# EAGLE design faun-two-layer-lipo-v1.0 (EAGLE 6.5.0)
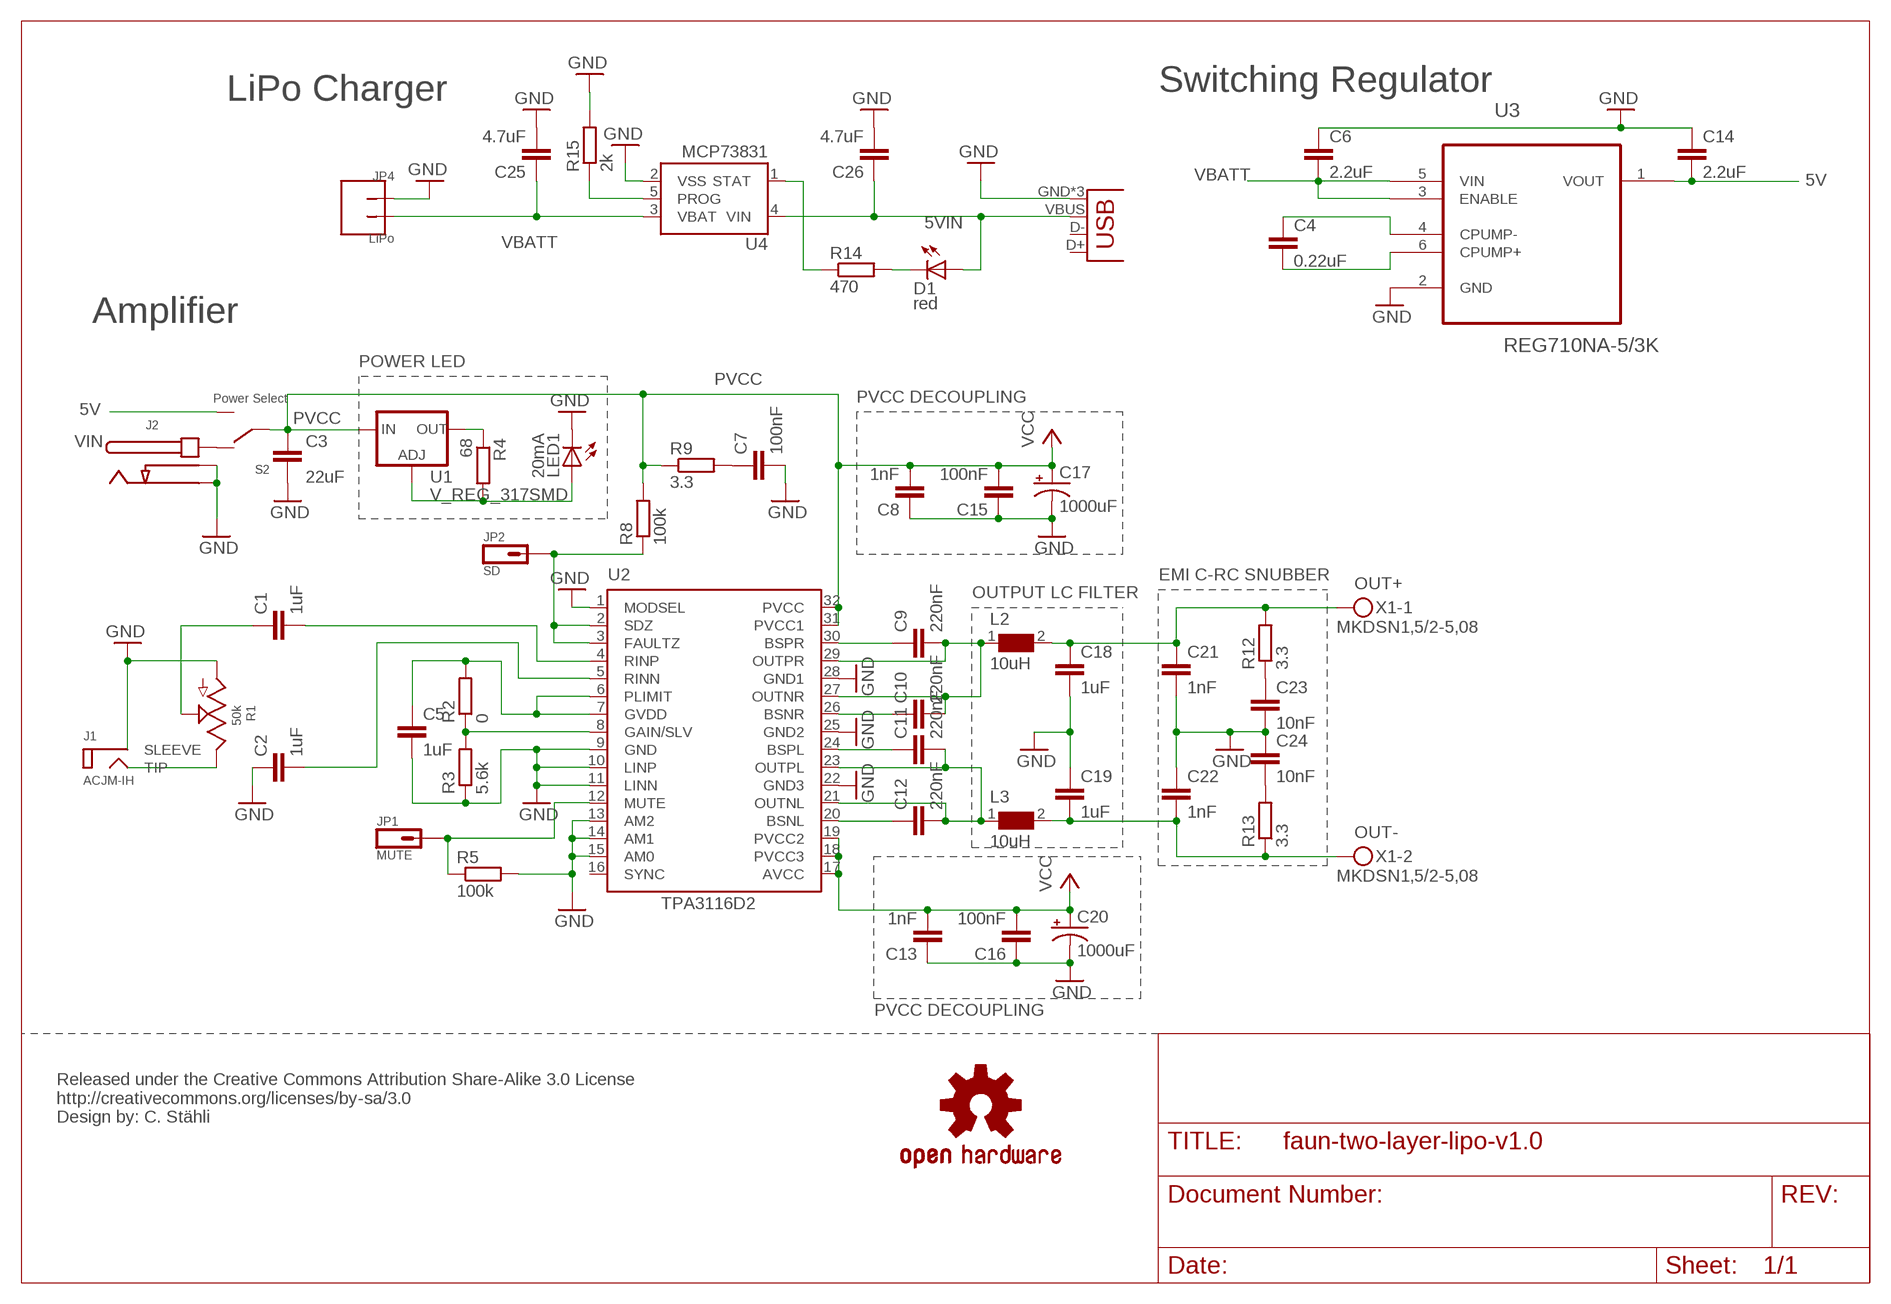
[diagram p0: schematic, sheet 1]

## Parts
C1  1uF  C-EUC1206  [C1206]
C2  1uF  C-EUC1206  [C1206]
C3  22uF  C-EUC1206  [C1206]
C4  0.22uF  C-EUC1206  [C1206]
C5  1uF  C-EUC1206  [C1206]
C6  2.2uF  C-EUC1206  [C1206]
C7  100nF  C-EUC1206  [C1206]
C8  1nF  C-EUC1206  [C1206]
C9  220nF  C-EUC1206  [C1206]
C10  220nF  C-EUC1206  [C1206]
C11  220nF  C-EUC1206  [C1206]
C12  220nF  C-EUC1206  [C1206]
C13  1nF  C-EUC1206  [C1206]
C14  2.2uF  C-EUC1206  [C1206]
C15  100nF  C-EUC1206  [C1206]
C16  100nF  C-EUC1206  [C1206]
C17  1000uF  UES1E102MHM  [UES1E102MHM]
C18  1uF  C-EUC1206  [C1206]
C19  1uF  C-EUC1206  [C1206]
C20  1000uF  UES1E102MHM  [UES1E102MHM]
C21  1nF  C-EUC1206  [C1206]
C22  1nF  C-EUC1206  [C1206]
C23  10nF  C-EUC1206  [C1206]
C24  10nF  C-EUC1206  [C1206]
C25  4.7uF  C-EUC1206  [C1206]
C26  4.7uF  C-EUC1206  [C1206]
D1  red  LED1206  [LED-1206]
J1  ACJM-IH  [ACJM-IH]
J2  PJ-102AH  [PJ-102AH]
JP1  MUTE  M01SMD-4.5X1.5  [PAD-1.5X4.5]
JP2  SD  M01SMD-4.5X1.5  [PAD-1.5X4.5]
JP4  LiPo  1778764  [1778764]
L2  10uH  WE-PD_1260/1245/1280/1210  [WE-PD_1260/1245/1280/1210]
L3  10uH  WE-PD_1260/1245/1280/1210  [WE-PD_1260/1245/1280/1210]
LED1  20mA  LED1206  [LED-1206]
OPEN_HARDWARE_LOGO  OSHW-LOGOL  [OSHW-LOGO-L]
OPEN_HARDWARE_LOGO_TOP  OSHW-LOGOL  [OSHW-LOGO-L]
R1  50k  PTD902-2015K-A503  [PTD902-2015K]
R2  0  R-EU_R1206  [R1206]
R3  5.6k  R-EU_R1206  [R1206]
R4  68  R-EU_R1206  [R1206]
R5  100k  R-EU_R1206  [R1206]
R8  100k  R-EU_R1206  [R1206]
R9  3.3  R-EU_R1206  [R1206]
R12  3.3  R-EU_R1206  [R1206]
R13  3.3  R-EU_R1206  [R1206]
R14  470  R-EU_R1206  [R1206]
R15  2k  R-EU_R1206  [R1206]
S2  Power Select  MS-100845  [MS-100845]
U1  V_REG_317SMD  [SOT223]
U2  TPA3116D2  [TPA3116D2]
U3  REG710NA-5/3K  [SOT95P280X145-6N]
U4  MCP73831  [SOT23-5]
X1  MKDSN1,5/2-5,08  [MKDSN1,5/2-5,08]
X2  USB-MICROB  [USB-MICROB]

## Nets
5V: C14.2 S2.P$3 U3.1(VOUT)
5VIN: C26.1 D1.A U4.4(VIN) X2.VBUS
GND: C2.1 C3.2 C5.2 C6.1 C7.2 C8.1 C13.1 C14.1 C15.1 C16.1 C17.- C18.2 C19.1 C20.- C21.2 C22.1 C23.2 C24.1 C25.2 C26.2 J1.SLEEVE@1(SLEEVE) J1.SLEEVE@2(SLEEVE) J2.GND@1 J2.GND@2 JP4.1 LED1.C R1.1 R1.1' R3.1 R5.2 R15.2 U2.1(MODSEL) U2.9(GND) U2.10(LINP) U2.11(LINN) U2.13(AM2) U2.14(AM1) U2.15(AM0) U2.22(GND3) U2.25(GND2) U2.28(GND1) U3.2(GND) U4.2(VSS) X2.GND X2.MT1(GND) X2.MT2(GND)
MUTE: JP1.P$1 R5.1 U2.12(MUTE)
N$1: C5.1 R2.2 U2.6(PLIMIT) U2.7(GVDD)
N$2: C9.1 U2.30(BSPR)
N$3: C2.2 U2.5(RINN)
N$4: J1.TIP@1(TIP) J1.TIP@2(TIP) R1.3 R1.3'
N$5: C1.2 U2.4(RINP)
N$6: C1.1 R1.2 R1.2'
N$7: C7.1 R9.2
N$8: R4.1 U1.2(OUT)
N$9: C10.1 U2.26(BSNR)
N$10: C9.2 C10.2 L2.1 U2.27(OUTNR) U2.29(OUTPR)
N$11: C11.1 U2.24(BSPL)
N$12: LED1.A R4.2 U1.1(ADJ)
N$13: C12.1 U2.20(BSNL)
N$14: C11.2 C12.2 L3.1 U2.21(OUTNL) U2.23(OUTPL)
N$15: R2.1 R3.2 U2.8(GAIN/SLV)
N$16: R15.1 U4.5(PROG)
N$17: C23.1 R12.1
N$18: C24.2 R13.2
N$19: R14.1 U4.1(STAT)
N$20: D1.C R14.2
N$21: C4.1 U3.4(CPUMP-)
N$22: C4.2 U3.6(CPUMP+)
OUT+: C18.1 C21.1 L2.2 R12.2 X1.1
OUT-: C19.2 C22.2 L3.2 R13.1 X1.2
PVCC: C3.1 C8.2 C13.2 C15.2 C16.2 C17.+ C20.+ R8.2 R9.1 S2.P$2(COMM) U1.3(IN) U2.17(AVCC) U2.18(PVCC3) U2.19(PVCC2) U2.31(PVCC1) U2.32(PVCC) ; supply symbol labelled VCC
SD: JP2.P$1 R8.1 U2.2(SDZ) U2.3(FAULTZ)
VBATT: C6.2 C25.1 JP4.2 U3.3(ENABLE) U3.5(VIN) U4.3(VBAT)
VIN: J2.VCC S2.P$1
Unconnected: U2.16(SYNC) X2.D+ X2.D-

## Notes on the sheet
- LiPo Charger
- Switching Regulator
- Amplifier
- POWER LED
- PVCC DECOUPLING
- EMI C-RC SNUBBER
- OUTPUT LC FILTER
- PVCC DECOUPLING
- Released under the Creative Commons Attribution Share-Alike 3.0 License
  http://creativecommons.org/licenses/by-sa/3.0
  Design by: C. Stähli

## Library data of the parts
C1-C16 C18 C19 C21-C26 = rcl:C-EU: CAPACITOR, European symbol
C17 C20 = faun:UES1E102MHM
D1 = SparkFun-LED:LED: LEDs Standard schematic elements and footprints for 5mm, 3mm, 1206, and 0603 sized LEDs. 5mm - Spark Fun Electronics SKU : COM-00529 (and others)
J1 = faun:ACJM-IH: 1/4” (6.35mmø) Jack, Horizontal PCB mount, Plastic housing and Bezel with threaded Metal nut.
J2 = faun:PJ-102AH
JP1 JP2 = faun:M01: Header 1 Standard 1-pin 0.1" header. Use with straight break away headers (SKU : PRT-00116), right angle break away headers (PRT-00553), swiss pins (PRT-00743), machine pins (PRT-00117), and female headers (PRT-00115).
JP4 = faun:1778764
L2 L3 = faun:WE-PD: SMD-Shielded Power Inductors WE-PD - Magnetically shielded version which results in a low leakage field - High storage capacity - Low self-losses - Highest possible current loading for SMD-Inducors -- Switching regulators with low operating voltages (computer, laptop, mobile phones, pagers) -- Integrated DC/DC-converter -- Is recommended for the application with switching regulators from National Semiconductor, Linear Technology, Texas Instruments and Fairchild Semiconductor, ect. -- Graphic cards -- Plastic base: Because of the one piece construction these are more suitable for high vibration or shock applications
LED1 = faun:LED: LEDs Standard schematic elements and footprints for 5mm, 3mm, 1206, and 0603 sized LEDs. 5mm - Spark Fun Electronics SKU : COM-00529 (and others)
OPEN_HARDWARE_LOGO OPEN_HARDWARE_LOGO_TOP = faun:OSHW-LOGO: Open Source Hardware Logo This logo indicates the piece of hardware it is found on incorporates a OSHW license and/or adheres to the definition of open source hardware found here: http://freedomdefined.org/OSHW
R1 = faun:PTD902-2015K-A503: PTD90 Series - 9 mm Multi-Ganged Potentiometer Manufacturer: Bourns Product Category: Potentiometers RoHS: RoHS Compliant Details Product: Dual Potentiometer Mounting Style: Through Hole Taper: Audio Number of Turns: 1 Resistance: 50 kOhms Power Rating: 25 mW Element Type: Carbon Shaft Type: Knurled / Serrated Termination Style: Pin Tolerance: 20 % Packaging: Bulk Shaft Diameter: 6 mm Shaft Length: 15 mm Factory Pack Quantity: 144
R2-R5 R8 R9 R12-R15 = rcl:R-EU_: RESISTOR, European symbol
S2 = faun:MS-100845: Slide Switches ON-OFF-ON SPDT
U1 = faun:V_REG_317: Voltage Regulator Standard LM317 adjustable voltage regulator. AOI (Adjust Output Input). Google 'LM317 Calculator' for easy to use app to get the two resistor values needed. 240/720 for 5V output. 240/390 for 3.3V output. Spark Fun Electronics SKU : COM-00527
U2 = faun:TPA3116D2: The TPA31xxD2 series are stereo efficient, digital amplifier power stage for driving speakers up to 100W/2Ω in mono. The high efficiency of the TPA3130D2 allows it to do 2x15W without external heat sink on a single layer PCB. The TPA3118D2 can even run 2x30W/8Ω without heat sink on a dual layer PCB. If even higher power is needed the TPA3116D2 does 2x50W/4Ω with a small heat-sink attached to its top side PowerPad. All three devices share the same footprint enabling a single PCB to be used across different power levels.
U3 = faun:REG710NA-5/3K: Buck/Boost Charge Pump; MPN: REG710NA-5/3K; PACKAGE: SOT-23-6; SUPPLIER: Texas Instruments
U4 = SparkFun:MCP73831: Microchip's MCP73831 Miniature single cell, fully integrated Li-Ion, Li-polymer charge management controller http://ww1.microchip.com/downloads/en/DeviceDoc/21984a.pdf
X1 = con-phoenix-508:MKDSN1,5/2-5,08: MKDSN 1,5/ 2-5,08 Printklemme Nennstrom: 13,5 A Nennspannung: 250 V Rastermaß: 5,08 mm Polzahl: 2 Anschlussart: Schraubanschluss Montage: Löten Anschlussrichtung Leiter/Platine: 0 ° Artikelnummer: 1729128 Source: http://eshop.phoenixcontact.com .. 1729128.pdf; MPN: MKDSN 1,5/2-5.08; OC_FARNELL: 1792903; OC_NEWARK: 30M2397
X2 = SparkFun-Connectors:USB: USB Connectors USB-B-PTH is fully proven SKU : PRT-00139/CONN-08278 USB-miniB is fully proven SKU : PRT-00587 USB-A-PCB is untested. USB-A-H is throughly reviewed, but untested. Spark Fun Electronics SKU : PRT-00437 USB-B-SMT is throughly reviewed, but untested. Needs silkscreen touching up. USB-A-S has not been used/tested USB-MB-H has not been used/tested USB-MICROB has been used. CONN-09505; PROD_ID: CONN-09505

## Board
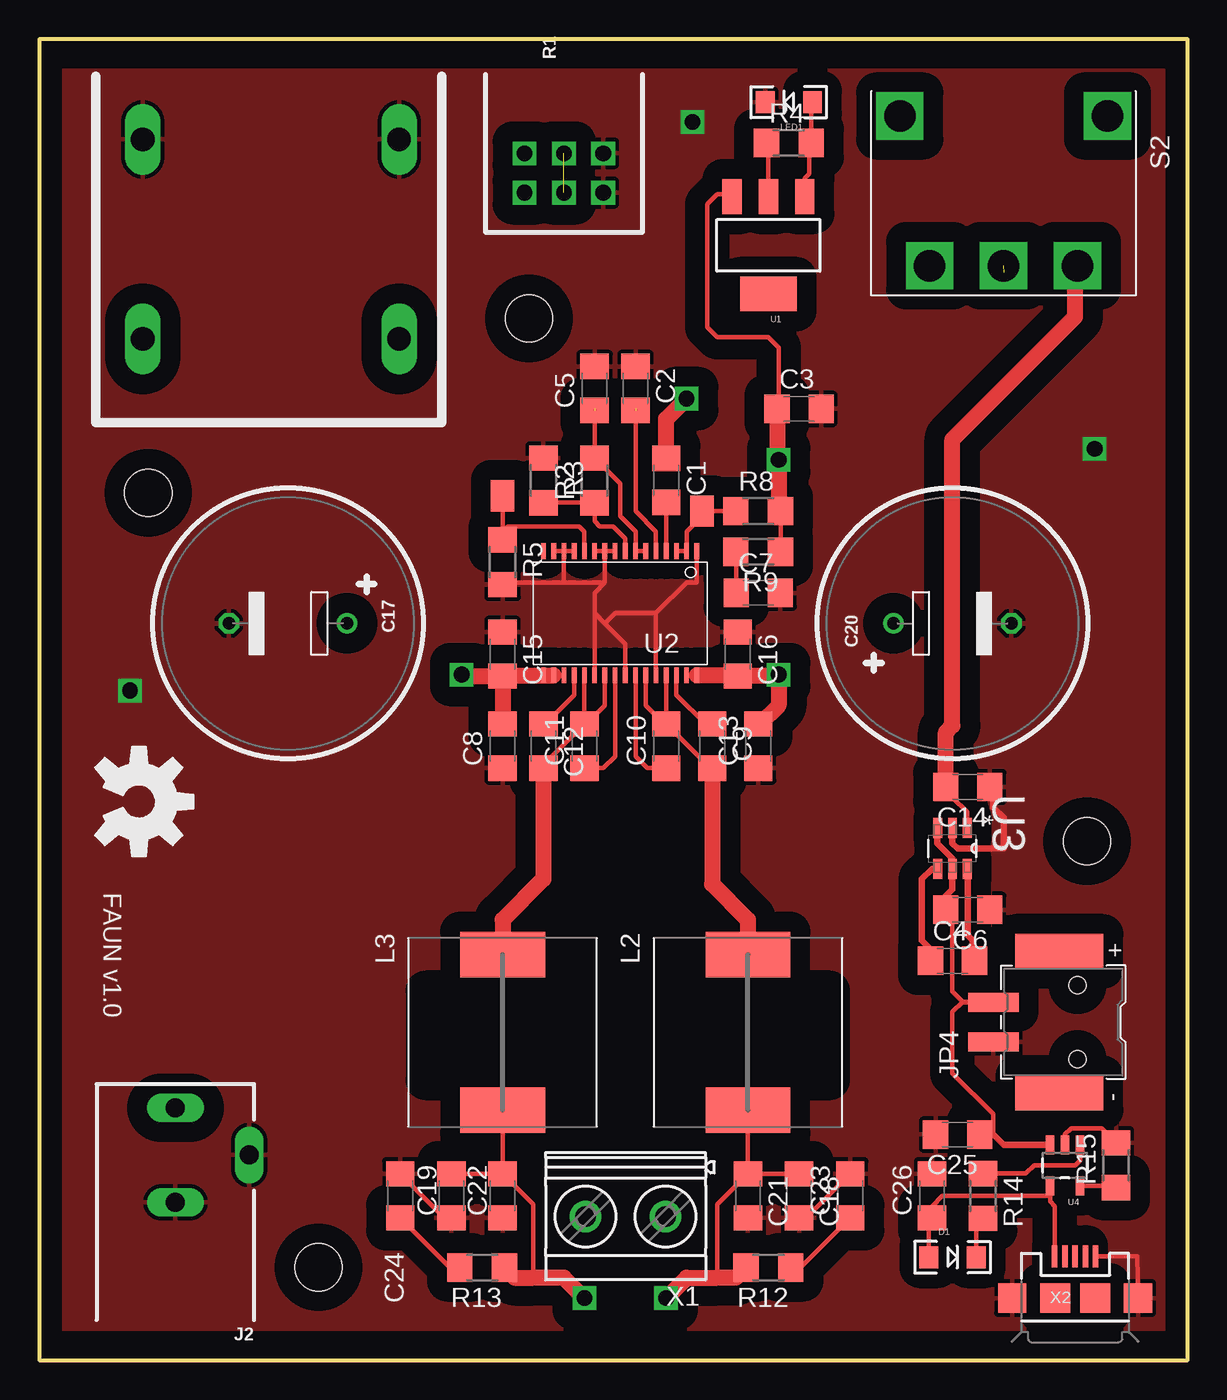
[diagram p1: board, top side]
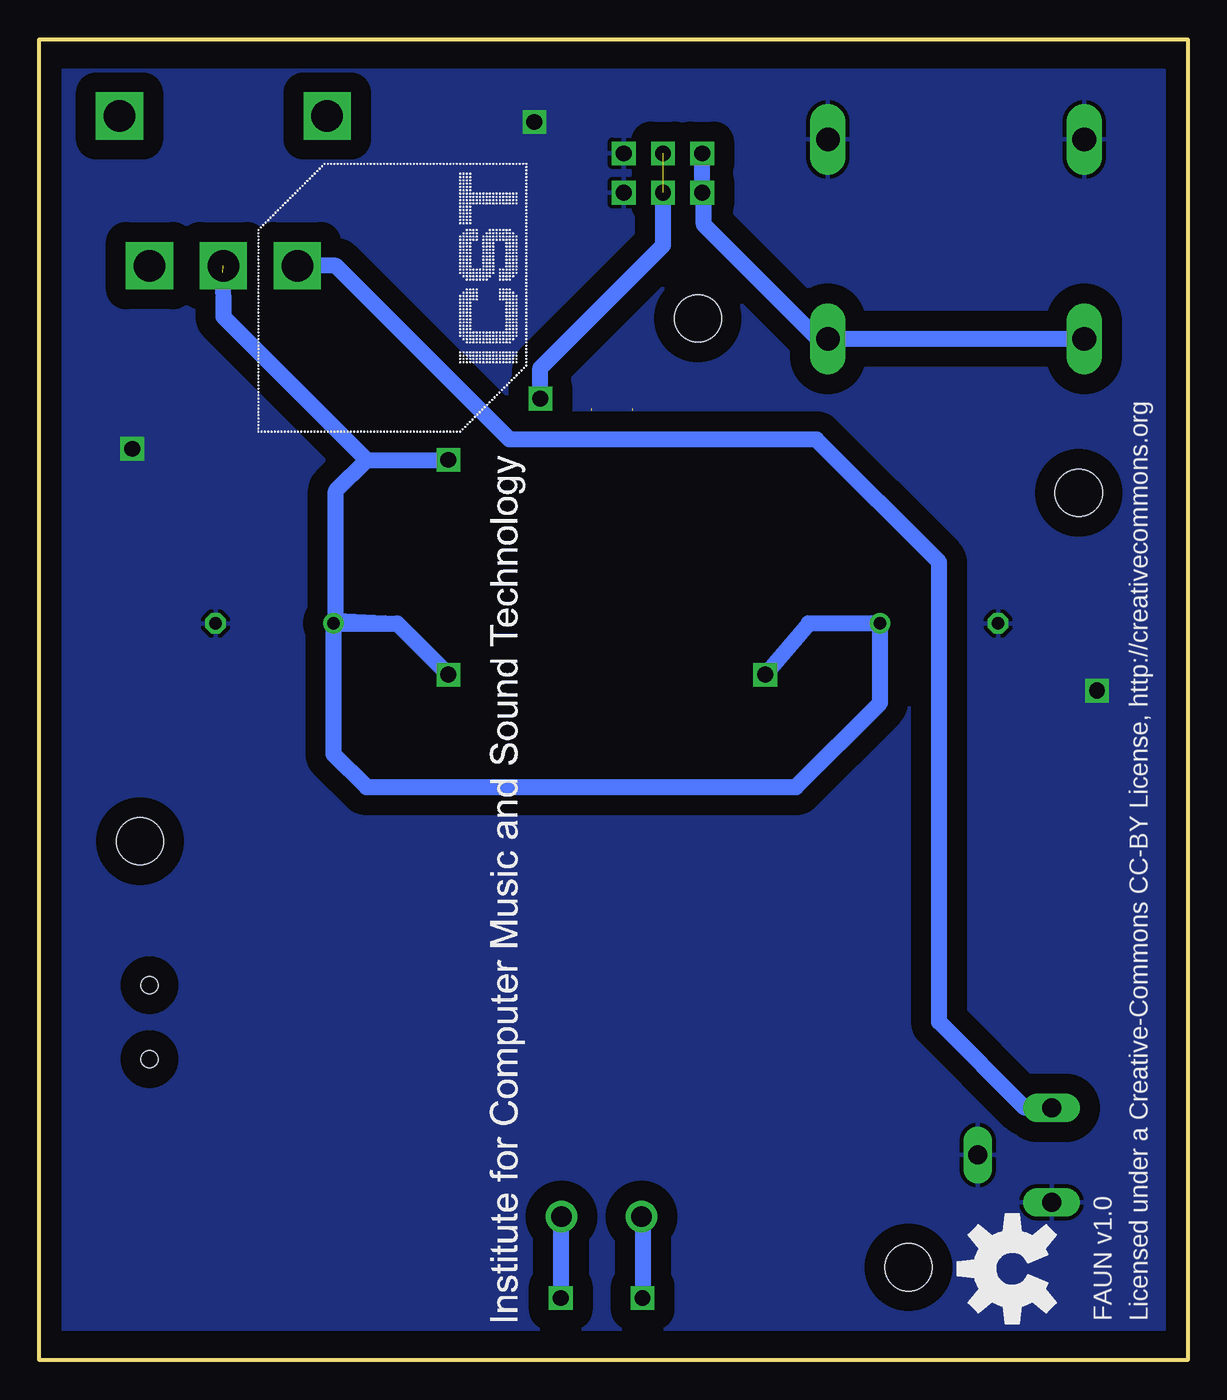
[diagram p2: board, bottom side, seen from below]

Size 73 x 84 mm. Coordinates in mm from the lower left corner, seen from the top.
Outline: 0,0 73,0 73,84 0,84 0,0
Copper layers (1*16): Top 0.035mm / dielectric 1.5mm / Bottom 0.035mm
Design rules "SeeedStudio_2layer_DRU_no_angle_20140221": minimum track width 6mil, minimum drill 12mil, track to track 6mil, track to pad 6mil, pad to pad 6mil, via to via 6mil, smd to smd 0mil, copper to edge 10mil, drill to drill 10mil, minimum pad ring 10mil, minimum via ring 6mil, stop-mask expansion 2mil, vias tented up to drill 100mil, thermal gap 10mil
Holes 3 mm at 66.6,33 17.75,5.9 31.13,66.25 6.92,55.16
tRestrict: area 24.6,17.8 to 36,23.5; area 38.8,17.8 to 50.3,23.5

### Footprints (pad centres in the part's own frame; a part is rotated, then mirrored left to right if it is on the bottom)
C1206 = smd 1.6 x 1.8: 1 -1.4,0; 2 1.4,0
UES1E102MHM = drill 0.8: + 0,3.75 | drill 0.8 octagon: - 0,-3.75
LED-1206 = smd 1.2 x 1.4: A -1.5,0; C 1.5,0
ACJM-IH = drill 1.5 long: SLEEVE@1 0,0; SLEEVE@2 0,-16.3; TIP@1 -12.7,0; TIP@2 -12.7,-16.3
PJ-102AH = drill 1.2 long: GND@1 0,3; GND@2 -4.7,0; VCC 0,-3
PAD-1.5X4.5 = smd 1.5 x 2: P$1 0,0
1778764 = smd 1.2 x 3.2: 1 -1.25,0; 2 1.25,0 | smd 2.2 x 5.6: P$3 -4.5,-4.2; P$4 4.5,-4.2 | hole 1.1: -2.35,-5.35; 2.35,-5.35
WE-PD_1260/1245/1280/1210 = smd 2.9 x 5.4: 1 -4.95,0; 2 4.95,0
PTD902-2015K = drill 1 square: 1 0,-2.5; 1' -2.5,-2.5; 2 0,0; 2' -2.5,0; 3 0,2.5; 3' -2.5,2.5
R1206 = smd 1.6 x 1.803: 1 -1.422,0; 2 1.422,0
MS-100845 = drill 2 square: P$1 0,-4.7; P$2 0,0; P$3 0,4.7; P$4 -9.53,6.6; P$5 -9.53,-6.6
SOT223 = smd 1.219 x 2.235: 1 -2.311,-3.099; 2 0,-3.099; 3 2.311,-3.099 | smd 3.6 x 2.2: 4 0,3.099
TPA3116D2 = smd 0.3 x 1: 1 -6.5,-3.95; 2 -5.85,-3.95; 3 -5.2,-3.95; 4 -4.55,-3.95; 5 -3.9,-3.95; 6 -3.25,-3.95; 7 -2.6,-3.95; 8 -1.95,-3.95; 9 -1.3,-3.95; 10 -0.65,-3.95; 11 0,-3.95; 12 0.65,-3.95; 13 1.3,-3.95; 14 1.95,-3.95; 15 2.6,-3.95; 16 3.25,-3.95; 17 3.25,3.95; 18 2.6,3.95; 19 1.95,3.95; 20 1.3,3.95; 21 0.65,3.95; 22 0,3.95; 23 -0.65,3.95; 24 -1.3,3.95; 25 -1.95,3.95; 26 -2.6,3.95; 27 -3.25,3.95; 28 -3.9,3.95; 29 -4.55,3.95; 30 -5.2,3.95; 31 -5.85,3.95; 32 -6.5,3.95
SOT95P280X145-6N = smd 1.27 x 0.559: 1 -1.295,0.94; 2 -1.295,0; 3 -1.295,-0.94; 4 1.295,-0.94; 5 1.295,0; 6 1.295,0.94
SOT23-5 = smd 0.55 x 1.2: 1 -0.95,-1.3; 2 0,-1.3; 3 0.95,-1.3; 4 0.95,1.3; 5 -0.95,1.3
MKDSN1,5/2-5,08 = drill 1.3 pad 2: 1 -2.561,0.025; 2 2.519,0.025
USB-MICROB = smd 0.35 x 1.4: D+ 0,2.65; D- -0.65,2.65; GND 1.3,2.65; ID 0.65,2.65; VBUS -1.3,2.65 | smd 1.8 x 1.9: MT1 -4,0; MT2 4,0 | smd 1.9 x 1.9: P$1 -1.27,0; P$2 1.27,0

### Placement (x,y rotation side)
C1  39.85,55.95 270 top
C2  37.9,61.8 270 top
C3  48.3,60.5 0 top
C4  58.05,25.4 0 top
C5  35.3,61.8 90 top
C6  59.02,28.65 180 top
C7  45.7,48.8 0 top
C8  29.45,39.05 90 top
C9  42.77,39.05 270 top
C10  39.85,39.05 90 top
C11  34.65,39.05 90 top
C12  32.05,39.05 270 top
C13  45.7,39.05 90 top
C14  59.02,36.45 180 top
C15  29.45,44.9 270 top
C16  44.4,44.9 270 top
C17  15.8,46.85 270 top
C18  48.3,10.45 270 top
C19  26.2,10.45 90 top
C20  58.05,46.85 90 top
C21  45.05,10.45 270 top
C22  29.45,10.45 90 top
C23  51.55,10.45 90 top
C24  22.95,10.45 270 top
C25  58.38,14.35 180 top
C26  56.75,10.45 90 top
D1  58.05,6.55 0 top
J1  6.57,77.64 90 top
J2  8.65,13.05 180 top
JP1  29.45,54.98 0 top
JP2  42.12,54 180 top
JP4  60.65,21.5 90 top
L2  45.05,20.85 270 top
L3  29.45,20.85 270 top
LED1  47.65,80 180 top
OPEN_HARDWARE_LOGO  11.15,5.81 90 bottom
OPEN_HARDWARE_LOGO_TOP  6.33,35.53 270 top
R1  33.35,76.75 90 top
R2  35.3,55.95 90 top
R3  32.05,55.95 270 top
R4  47.65,77.4 0 top
R5  29.45,50.75 270 top
R8  45.7,54 0 top
R9  45.7,51.4 180 top
R12  46.35,5.9 180 top
R13  28.15,5.9 180 top
R14  60,10.45 270 top
R15  68.45,12.4 90 top
S2  61.3,69.6 270 top
U1  46.35,70.9 180 top
U2  35.3,47.5 180 top
U3  58.05,32.55 270 top
U4  65.2,12.4 180 top
U$2  [ICST-LOGO]  41.98,2.49 90 bottom
X1  37.25,9.15 180 top
X2  65.85,3.95 0 top

### Tracks (layer width: path | path; a pad name or v marks a point on that pad's centre or on a via)
5V
  Top 0.3: U3.1 58.99,34.86 58.05,35.8 58.05,36.02 C14.2
  Top 1.016: C14.2 57.62,39.92 58.05,40.35 58.05,58.55 65.85,66.35 65.85,69.45 S2.P$3
5VIN
  Top 0.3: D1.A 56.55,8.85 C26.1 56.75,9.8 57.4,10.45 64.22,10.45 64.39,10.61 64.39,10.96 U4.4 64.25,10.1 64.55,9.8 X2.VBUS
GND  (via drill 1)
  Top 0.3: U2.13 U2.14 | U2.14 U2.15 | R5.2 29.57,49.45 33.35,49.45 | 33.35,49.45 U2.14 | 33.35,49.45 35.95,49.45 | 35.95,49.45 35.3,48.8 35.3,47.5 | 35.3,47.5 U2.22 | 35.3,47.5 35.95,46.85 | 35.95,46.85 37.25,45.55 U2.25 | 35.95,46.85 36.6,47.5 39.2,47.5 | 39.2,47.5 U2.28 | 39.2,47.5 41.15,49.45 41.8,49.45 U2.1 | C24.1 25.75,9.05 C19.1 | C23.2 48.75,9.05 C18.2 | U2.9 U2.10 U2.11 35.9,51.45 35.95,51.4 35.95,49.45 | U4.2 65.2,14.35 65.59,14.74 67.55,14.75 R15.2 | X2.GND 69.8,6.6 X2.MT2
  Top 0.406: U3.2 58.05,32.88 58.38,32.55 61.3,32.55 61.3,34.5 60.65,35.15 60.65,36.35 C14.1
  other vias: 67.09,57.96 5.77,42.58 41.53,78.74
  pour Top (isolate 1.27): 1.5,82 71.5,82 71.5,2 1.5,2
  pour Bottom (isolate 1.27): 1.5,82 71.5,82 71.5,2 1.5,2
MUTE
  Top 0.3: JP1.P$1 29.45,52.7 | 29.45,52.7 R5.1 | U2.12 34.65,52.7 34.33,53.02 29.77,53.02 29.45,52.7
N$1  (1 unrouted)
  Top 0.3: U2.6 U2.7 37.9,52.7 36.92,53.67 36.92,55.75 R2.2 35.3,60.5 | C5.1 35.2,60.5
N$2
  Top 0.3: U2.30 40.5,42.3 42.35,40.45 C9.1
N$3  (1 unrouted)
  Top 0.3: C2.2 37.8,59.85 | 37.9,60.5 37.9,54 39.2,52.7 U2.5
N$4
  Bottom 1.016: J1.TIP@1 J1.TIP@2 23.49,64.94 30.75,72.2 30.75,74.15 R1.3' R1.3
N$5
  Top 0.3: C1.2 U2.4
N$6  (via drill 1)  (1 unrouted)
  Top 1.016: C1.1 39.85,59.85 v41.15,61.15
  Bottom 1.016: v41.15,61.15 41.15,63.1 33.35,70.9 R1.2'
N$7
  Top 0.3: R9.2 44.3,50.08 C7.1
N$8
  Top 0.3: U1.2 46.35,77.28
  Top 0.406: 46.35,77.28 R4.1
N$9
  Top 0.3: U2.26 37.9,38.4 38.65,37.65 C10.1
  Top 0.406: 39.81,37.66 C10.1
N$10
  Top 0.3: L2.1 43.42,25.61 42.66,26.37 | U2.29 C10.2 | U2.27 38.55,41.65 39.75,40.45 C10.2 | C10.2 42.65,37.65 C9.2
  Top 1.016: C9.2 42.77,30.27 45.05,28 L2.1
N$11
  Top 0.3: U2.24 36.6,38.4 35.85,37.65 C11.1
N$12
  Top 0.3: R4.2 49.07,79.92 | U1.1 48.66,75.16 48.95,75.45 48.95,77.28
  Top 0.406: 49.07,79.92 LED1.A | 48.95,77.28 R4.2
N$13
  Top 0.3: U2.20 34,42.3 32.15,40.45 C12.1
N$14
  Top 0.3: U2.21 34.65,41 | 34.65,41 C11.2 32.05,37.85 C12.2 | U2.23 35.95,41.65 35.3,41 34.65,41
  Top 1.016: C12.2 32.05,30.6 29.45,28 L3.1
N$15
  Top 0.3: U2.8 37.25,52.25 36.48,53.02 35.62,53.02 35.3,53.35 R2.1 R3.2
N$16
  Top 0.3: U4.5 68.33,11.1 R15.1
N$17
  Top 0.3: C23.1 48.4,5.9 R12.1
N$18
  Top 0.3: C24.2 26.1,5.9 R13.2
N$19
  Top 0.3: R14.1 62.72,11.87 63.25,12.4 65.85,12.4 66.17,12.72 66.17,13.68 U4.1
N$20
  Top 0.3: D1.C 59.55,8.58 R14.2
N$21
  Top 0.406: C4.1 56.65,26.15 56.1,26.7 56.1,30.6 56.75,31.25 U3.4
N$22
  Top 0.406: C4.2 59.35,25.4 59.35,26.7 59.02,27.02 59.02,31.22 U3.6
OUT+  (via drill 1)
  Top 0.3: C21.1 C18.1 | 44.87,6.37 R12.2 44.28,5.25 | C21.1 43.1,9.9 43.1,5.25 | L2.2 C21.1
  Top 1.016: 44.28,5.25 43.1,5.25 41.15,5.25 v39.85,3.95
  Bottom 0.3: X1.1 39.85,9.09
  Bottom 1.016: 39.85,9.09 v39.85,3.95
OUT-  (via drill 1)
  Top 0.3: L3.2 C22.2 | C22.2 C19.2 | C22.2 31.4,9.9 31.4,5.25 | R13.1 30.22,5.25
  Top 1.016: 30.22,5.25 31.4,5.25 33.35,5.25 v34.65,3.95
  Bottom 0.3: X1.2 34.65,9.04
  Bottom 1.016: 34.65,9.04 v34.65,3.95
PVCC  (via drill 1)  (1 unrouted)
  Top 0.3: U2.31 U2.32 | U2.19 U2.18 32.7,43.6 32.65,43.55 U2.17 | R8.2 R9.1 | 43.6,74 U1.3 43.89,74.15 43.1,74.15 42.45,73.5 42.45,65.7 43.1,65.05 46.35,65.05 47,64.4 47,60.6 C3.1
  Top 1.016: C15.2 C8.2 | C15.2 29.5,43.55 U2.17 U2.18 | U2.32 44.35,43.55 C16.2 46.9,43.5 v47,43.6 47,41.65 45.8,40.45 C13.2 | v26.85,43.6 26.95,43.5 C15.2 | R8.2 47,54.12 v47,57.25 46.9,57.35 C3.1
  Bottom 1.016: 51.05,46.85 C20.+ 54.3,38.55 52.2,36.45 24.9,36.45 19.55,41.8 C17.+ 24.1,46.85 v26.85,43.6 | 51.05,46.85 50.25,46.85 v47,43.6 | 51.05,46.85 54.15,47 54.15,55.3 52.2,57.25 | 61.34,69.15 61.3,66.35 52.2,57.25 | 52.2,57.25 v47,57.25
SD
  Top 0.3: U2.3 U2.2 41.15,52.7 42.12,53.67 JP2.P$1 R8.1
VBATT
  Top 0.3: 60.65,14.35 60.65,15.65 58.05,18.25 58.05,22.15 58.7,22.8 60.6,22.8 JP4.2 58.75,22.75 58.05,23.45 58.05,28.23 C6.2
  Top 0.406: C25.1 60.65,14.35 61.3,13.7 U4.3 | C6.2 57.62,29.52 58.05,29.95 U3.5 58.05,31.9 57.08,32.88 57.08,33.81 U3.3
VIN
  Bottom 1.016: J2.VCC 10.35,16.05 15.8,21.5 15.8,50.75 23.6,58.55 43.1,58.55 54.15,69.6 S2.P$1

### Text on the board
tPlace: + | FAUN v1.0 | -
bPlace: Licensed under a Creative-Commons CC-BY License, http://creativecommons.org | FAUN v1.0